# EAGLE schematic helmetschem (EAGLE 7.1.0)
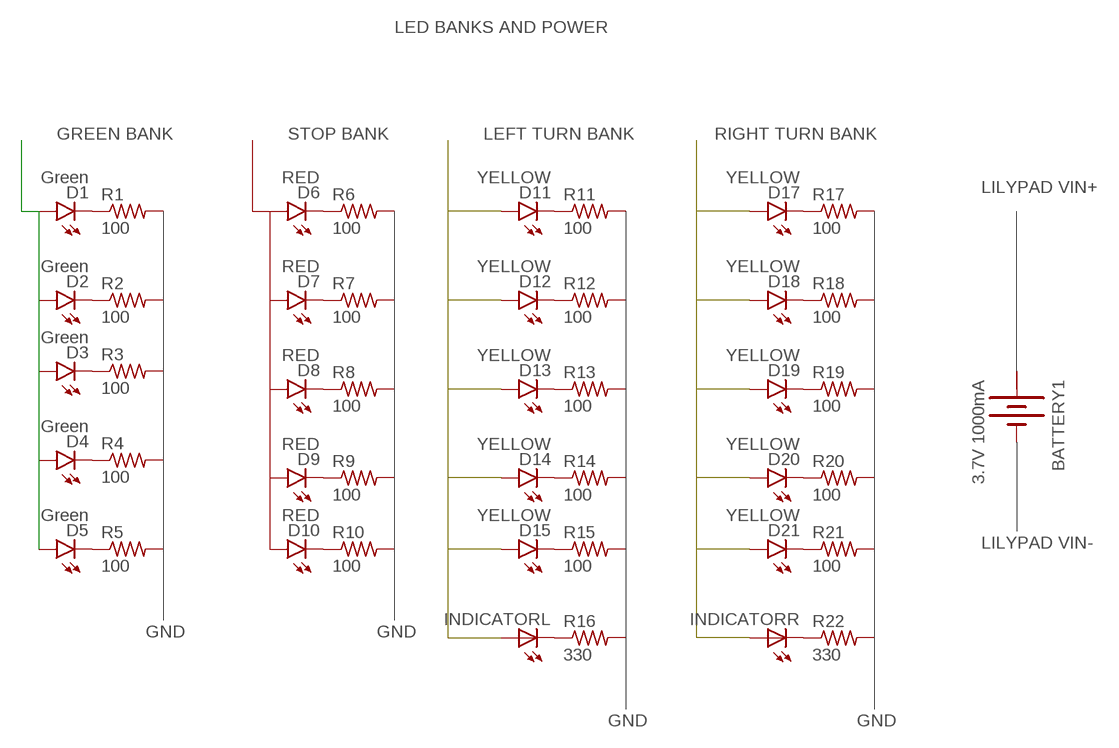
[diagram p0: schematic, sheet 1]

## Parts
BATTERY1  3.7V 1000mA  BATTERY  [BATTERY]
D1  Green  LED-GREEN1206-BOTTOM  [LED-1206-BOTTOM]
D2  Green  LED-GREEN1206-BOTTOM  [LED-1206-BOTTOM]
D3  Green  LED-GREEN1206-BOTTOM  [LED-1206-BOTTOM]
D4  Green  LED-GREEN1206-BOTTOM  [LED-1206-BOTTOM]
D5  Green  LED-GREEN1206-BOTTOM  [LED-1206-BOTTOM]
D6  RED  LED-RED1206  [LED-1206]
D7  RED  LED-RED1206  [LED-1206]
D8  RED  LED-RED1206  [LED-1206]
D9  RED  LED-RED1206  [LED-1206]
D10  RED  LED-RED1206  [LED-1206]
D11  YELLOW  LED-YELLOWLARGE  [LED-1206]
D12  YELLOW  LED-YELLOWLARGE  [LED-1206]
D13  YELLOW  LED-YELLOWLARGE  [LED-1206]
D14  YELLOW  LED-YELLOWLARGE  [LED-1206]
D15  YELLOW  LED-YELLOWLARGE  [LED-1206]
D17  YELLOW  LED-YELLOWLARGE  [LED-1206]
D18  YELLOW  LED-YELLOWLARGE  [LED-1206]
D19  YELLOW  LED-YELLOWLARGE  [LED-1206]
D20  YELLOW  LED-YELLOWLARGE  [LED-1206]
D21  YELLOW  LED-YELLOWLARGE  [LED-1206]
INDICATORL  LED  [SMARTLED-TTW]
INDICATORR  LED  [SMARTLED-TTW]
R1  100  R-US_0204/2V  [0204V]
R2  100  R-US_0204/2V  [0204V]
R3  100  R-US_0204/2V  [0204V]
R4  100  R-US_0204/2V  [0204V]
R5  100  R-US_0204/2V  [0204V]
R6  100  R-US_0204/2V  [0204V]
R7  100  R-US_0204/2V  [0204V]
R8  100  R-US_0204/2V  [0204V]
R9  100  R-US_0204/2V  [0204V]
R10  100  R-US_0204/2V  [0204V]
R11  100  R-US_0204/2V  [0204V]
R12  100  R-US_0204/2V  [0204V]
R13  100  R-US_0204/2V  [0204V]
R14  100  R-US_0204/2V  [0204V]
R15  100  R-US_0204/2V  [0204V]
R16  330  R-US_0204/2V  [0204V]
R17  100  R-US_0204/2V  [0204V]
R18  100  R-US_0204/2V  [0204V]
R19  100  R-US_0204/2V  [0204V]
R20  100  R-US_0204/2V  [0204V]
R21  100  R-US_0204/2V  [0204V]
R22  330  R-US_0204/2V  [0204V]

## Nets
N$1: D1.C R1.1
N$2: D2.C R2.1
N$3: D3.C R3.1
N$4: D4.C R4.1
N$5: D5.C R5.1
N$6: D6.C R6.1
N$7: D7.C R7.1
N$8: D8.C R8.1
N$9: D9.C R9.1
N$10: D10.C R10.1
N$11: D11.C R11.1
N$12: D12.C R12.1
N$13: D13.C R13.1
N$14: D14.C R14.1
N$15: D15.C R15.1
N$16: INDICATORL.C@1(C) R16.1
N$17: D17.C R17.1
N$18: D18.C R18.1
N$19: D19.C R19.1
N$20: D20.C R20.1
N$21: D21.C R21.1
N$22: INDICATORR.C@1(C) R22.1
N$23: D1.A D2.A D3.A D4.A D5.A
Unconnected: D6.A D7.A D8.A D9.A D10.A D11.A D12.A D13.A D14.A D15.A D17.A D18.A D19.A D20.A D21.A INDICATORL.A@1(A) INDICATORR.A@1(A) R1.2 R2.2 R3.2 R4.2 R5.2 R6.2 R7.2 R8.2 R9.2 R10.2 R11.2 R12.2 R13.2 R14.2 R15.2 R16.2 R17.2 R18.2 R19.2 R20.2 R21.2 R22.2

## Notes on the sheet
- LED BANKS AND POWER
- GREEN BANK | STOP BANK | LEFT TURN BANK | RIGHT TURN BANK
- LILYPAD VIN+
- LILYPAD VIN-
- GND | GND
- GND | GND

## Power pins joined to a net without a drawn wire
+: BATTERY1.+ BATTERY1.+@1(+)
-: BATTERY1.-

## Library data of the parts
BATTERY1 = special:BATTERY: BATTERY
D1-D5 = SparkFun-LED:LED-GREEN: Various green LEDs Green LEDs used in SFE Production 0603- DIO-00821 LARGE- DIO-00862 LILYPAD- DIO-09910; PROD_ID: DIO-11076
D6-D10 = SparkFun-LED:LED-RED: Assorted Red LEDs LilyPad 1206- DIO-09912 1206- DIO-00809 0603- DIO-00819; PROD_ID: DIO-00809
D11-D15 D17-D21 = SparkFun-LED:LED-YELLOW: Yellow SMD LEDs LilyPad 1206- DIO-09909 0603- DIO-09003; PROD_ID: DIO-00820
INDICATORL INDICATORR = adafruit:LED: LED OSRAM: - CHIPLED LG R971, LG N971, LY N971, LG Q971, LY Q971, LO R971, LY R971 LH N974, LH R974 LS Q976, LO Q976, LY Q976 LO Q996 - Hyper CHIPLED LW Q18S LB Q993, LB Q99A, LB R99A - SideLED LS A670, LO A670, LY A670, LG A670, LP A670 LB A673, LV A673, LT A673, LW A673 LH A674 LY A675 LS A676, LA A676, LO A676, LY A676, LW A676 LS A679, LY A679, LG A679 - Hyper Micro SIDELED® LS Y876, LA Y876, LO Y876, LY Y876 LT Y87S - SmartLED LW L88C, LW L88S LB L89C, LB L89S, LG L890 LS L89K, LO L89K, LY L89K LS L896, LA L896, LO L896, LY L896 - TOPLED LS T670, LO T670, LY T670, LG T670, LP T670 LSG T670, LSP T670, LSY T670, LOP T670, LYG T670 LG T671, LOG T671, LSG T671 LB T673, LV T673, LT T673, LW T673 LH T674 LS T676, LA T676, LO T676, LY T676, LB T676, LH T676, LSB T676, LW T676 LB T67C, LV T67C, LT T67C, LS T67K, LO T67K, LY T67K, LW E67C LS E67B, LA E67B, LO E67B, LY E67B, LB E67C, LV E67C, LT E67C LW T67C LS T679, LY T679, LG T679 LS T770, LO T770, LY T770, LG T770, LP T770 LB T773, LV T773, LT T773, LW T773 LH T774 LS E675, LA E675, LY E675, LS T675 LS T776, LA T776, LO T776, LY T776, LB T776 LHGB T686 LT T68C, LB T68C - Hyper Mini TOPLED® LB M676 - Mini TOPLED Santana® LG M470 LS M47K, LO M47K, LY M47K Source: http://www.osram.convergy.de/
R1-R22 = adafruit:R-US_: RESISTOR, American symbol